# Altium schematic sheet MPU9250.SchDoc
size A4; SheetNumber: 3; SheetTotal: 7
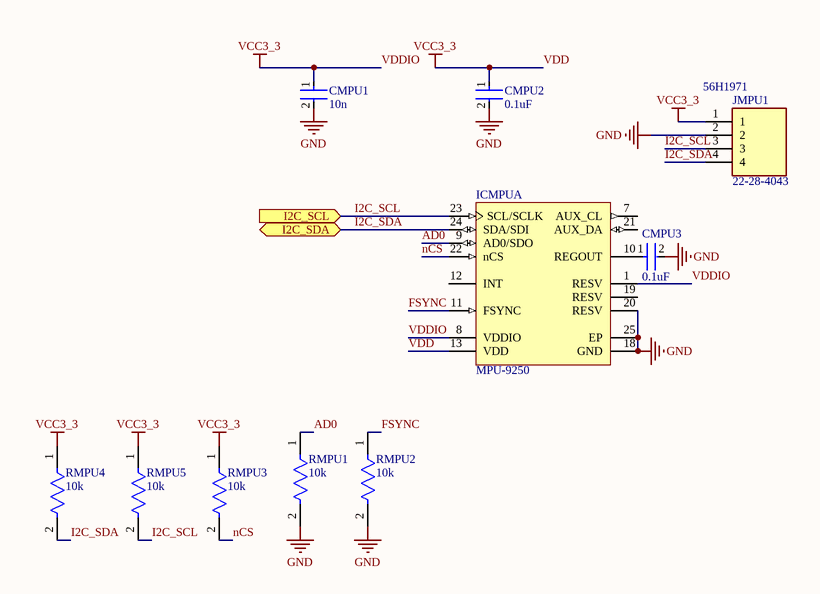
[diagram p0: MPU9250.SchDoc]

## Parts
CMPU1  10n  [FP-CL10-IPC_A]
CMPU2  0.1uF  [FP-CL10-IPC_C]
CMPU3  0.1uF  [FP-CL10-IPC_C]
ICMPU  MPU-9250  [INSE-QFN-24-1700X1540TP_M]  (part A of 2)
JMPU1  22-28-4043  Supplier Part Number 1: 56H1971  [HDRV4W87P0X254_1X4_1016X249X863P]
RMPU1  10k  [FP-ERJ3G-IPC_C]
RMPU2  10k  [FP-ERJ3G-IPC_C]
RMPU3  10k  [FP-ERJ3G-IPC_C]
RMPU4  10k  [FP-ERJ3G-IPC_C]
RMPU5  10k  [FP-ERJ3G-IPC_C]

## Ports
I2C_SCL (in), I2C_SDA (bidir)

## Nets
GND: CMPU1.2 CMPU2.2 CMPU3.2 ICMPU.18(GND) ICMPU.20(RESV) ICMPU.25(EP) JMPU1.2 RMPU1.2 RMPU2.2
VDD: CMPU1.1 CMPU2.1 ICMPU.1(RESV) ICMPU.8(VDDIO) ICMPU.13(VDD) JMPU1.1 RMPU3.1 RMPU4.1 RMPU5.1  [also labelled VCC3_3, VDDIO]
AD0: ICMPU.9(AD0/SDO) RMPU1.1
FSYNC: ICMPU.11(FSYNC) RMPU2.1
I2C_SCL: ICMPU.23(SCL/SCLK) JMPU1.3 RMPU5.2 ; port I2C_SCL
I2C_SDA: ICMPU.24(SDA/SDI) JMPU1.4 RMPU4.2 ; port I2C_SDA
nCS: ICMPU.22(nCS) RMPU3.2
NetCMPU3_1: CMPU3.1 ICMPU.10(REGOUT)

Not connected (* = marked no-connect by the designer): ICMPU 7(AUX_CL) 12(INT) 19(RESV) 21(AUX_DA)

## Library data of the parts
CMPU1 = CMP-13271-001215-1: Cap Ceramic 10nF 50V X7R ±10% Pad SMD 0603 +125°C T/R; Dielectric: X7R; Features: Soft Termination; Packaging: Tape and Reel; Voltage Rating: 50V; Ratings: AEC-Q200; Radiation Hardening: No; Height: 0.8mm; Package Quantity: 4000; Case Code (Metric): 1608; Capacitance: 10nF; Length: 1.6mm; Width: 0.031inch; Case/Package: 0603; Thickness: 0.035inch; Tolerance: 10%; Max Operating Temperature: 125°C; Lead Free: Lead Free; Mount: Surface Mount; Min Operating Temperature: -55°C; Case Code (Imperial): 0603; Voltage: 50V; Depth: 0.8mm
CMPU2 CMPU3 = CMP-13271-001724-1: Cap Ceramic 100nF 50V X7R ±20% Pad SMD 0603 +125°C T/R; Mount: Surface Mount; Lead Free: Lead Free; Max Operating Temperature: 125°C; Voltage Rating: 50V; Case Code (Imperial): 0603; Capacitance: 100nF; Height: 0.8mm; Length: 1.6mm; Tolerance: 20%; Case Code (Metric): 1608; Thickness: 0.035inch; Depth: 0.8mm; Width: 0.031inch; Package Quantity: 1; Min Operating Temperature: -55°C; Case/Package: 0603; Radiation Hardening: No; Voltage Rating (DC): 50V; Dielectric: X7R; Packaging: Tape and Reel
ICMPU = CMP-010-00006-3: 9-axis MotionTracking device, 2.4 to 3,6 V, -40 to 85 degC, 24-Pin QFN, RoHS, Tape and Reel; Manufacturer: InvenSense; Sensor Type: Motion; Max Supply Voltage: 3.6V; Min Supply Voltage: 2.4V; Package Description: 24-Pin Quad Flat No-lead Package, Body 3 x 3 mm, Pitch 0.4 mm; RoHS Compliant: True; Datasheet Version: Rev. 1.0, 01/2014; Pins: 24; Mounting Technology: SM; Datasheet URL: http://datasheet.octopart.com/MPU-9250-InvenSense-datasheet-21859386.pdf; Package Quantity: 5000; Package Reference: QFN-24; Case/Package: Module
JMPU1 = 22-28-4043: Connector; Manufacturer_Name: Molex; Datasheet Link: http://www.molex.com/molex/products/datasheet.jsp?part=active/0022284023_PCB_HEADERS.xml; Height: 8.63mm; Manufacturer_Part_Number: 22-28-4043; Mouser Part Number: 538-22-28-4043; Mouser Price/Stock: https://www.mouser.co.uk/ProductDetail/Molex/22-28-4043?qs=MuwpYaHj751%252Bm8qLwZDsXA%3D%3D; Supplier 1: Newark
RMPU1-RMPU5 = CMP-2000-00704-2: RES SMD 10K OHM 5% 1/10W 0603; Temperature Coefficient: 200ppm/°C; Max Power Dissipation: 100mW; Resistance: 10kR; Voltage Rating (DC): 50V; Voltage Rating: 75V; Resistor Type: Thick Film; Tolerance: 5%; Military Standard: Not; Package Quantity: 1; Max Operating Temperature: 155°C; Mount: Surface Mount; Technology: THICK FILM; Case/Package: 0603; Construction: Rectangular; Depth: 0.8mm; Case Code (Imperial): 0603; Weight: 7.1E-05oz; Features: Automotive AEC-Q200; Packaging: Tape and Reel; Width: 0.8mm; Length: 1.6mm; Termination: SMD/SMT; Power Rating: 100mW; Lead Free: Lead Free; Number of Terminations: 2; Height: 0.45mm; RoHS Compliant: Yes; Min Operating Temperature: -55°C; Contact Plating: Tin; REACH SVHC: No SVHC; Resistance Tolerance: 5%; Series: ERJ; Working Voltage: 75V; Case Code (Metric): 1608